# EAGLE schematic esquematico_pds (EAGLE 7.3.0)
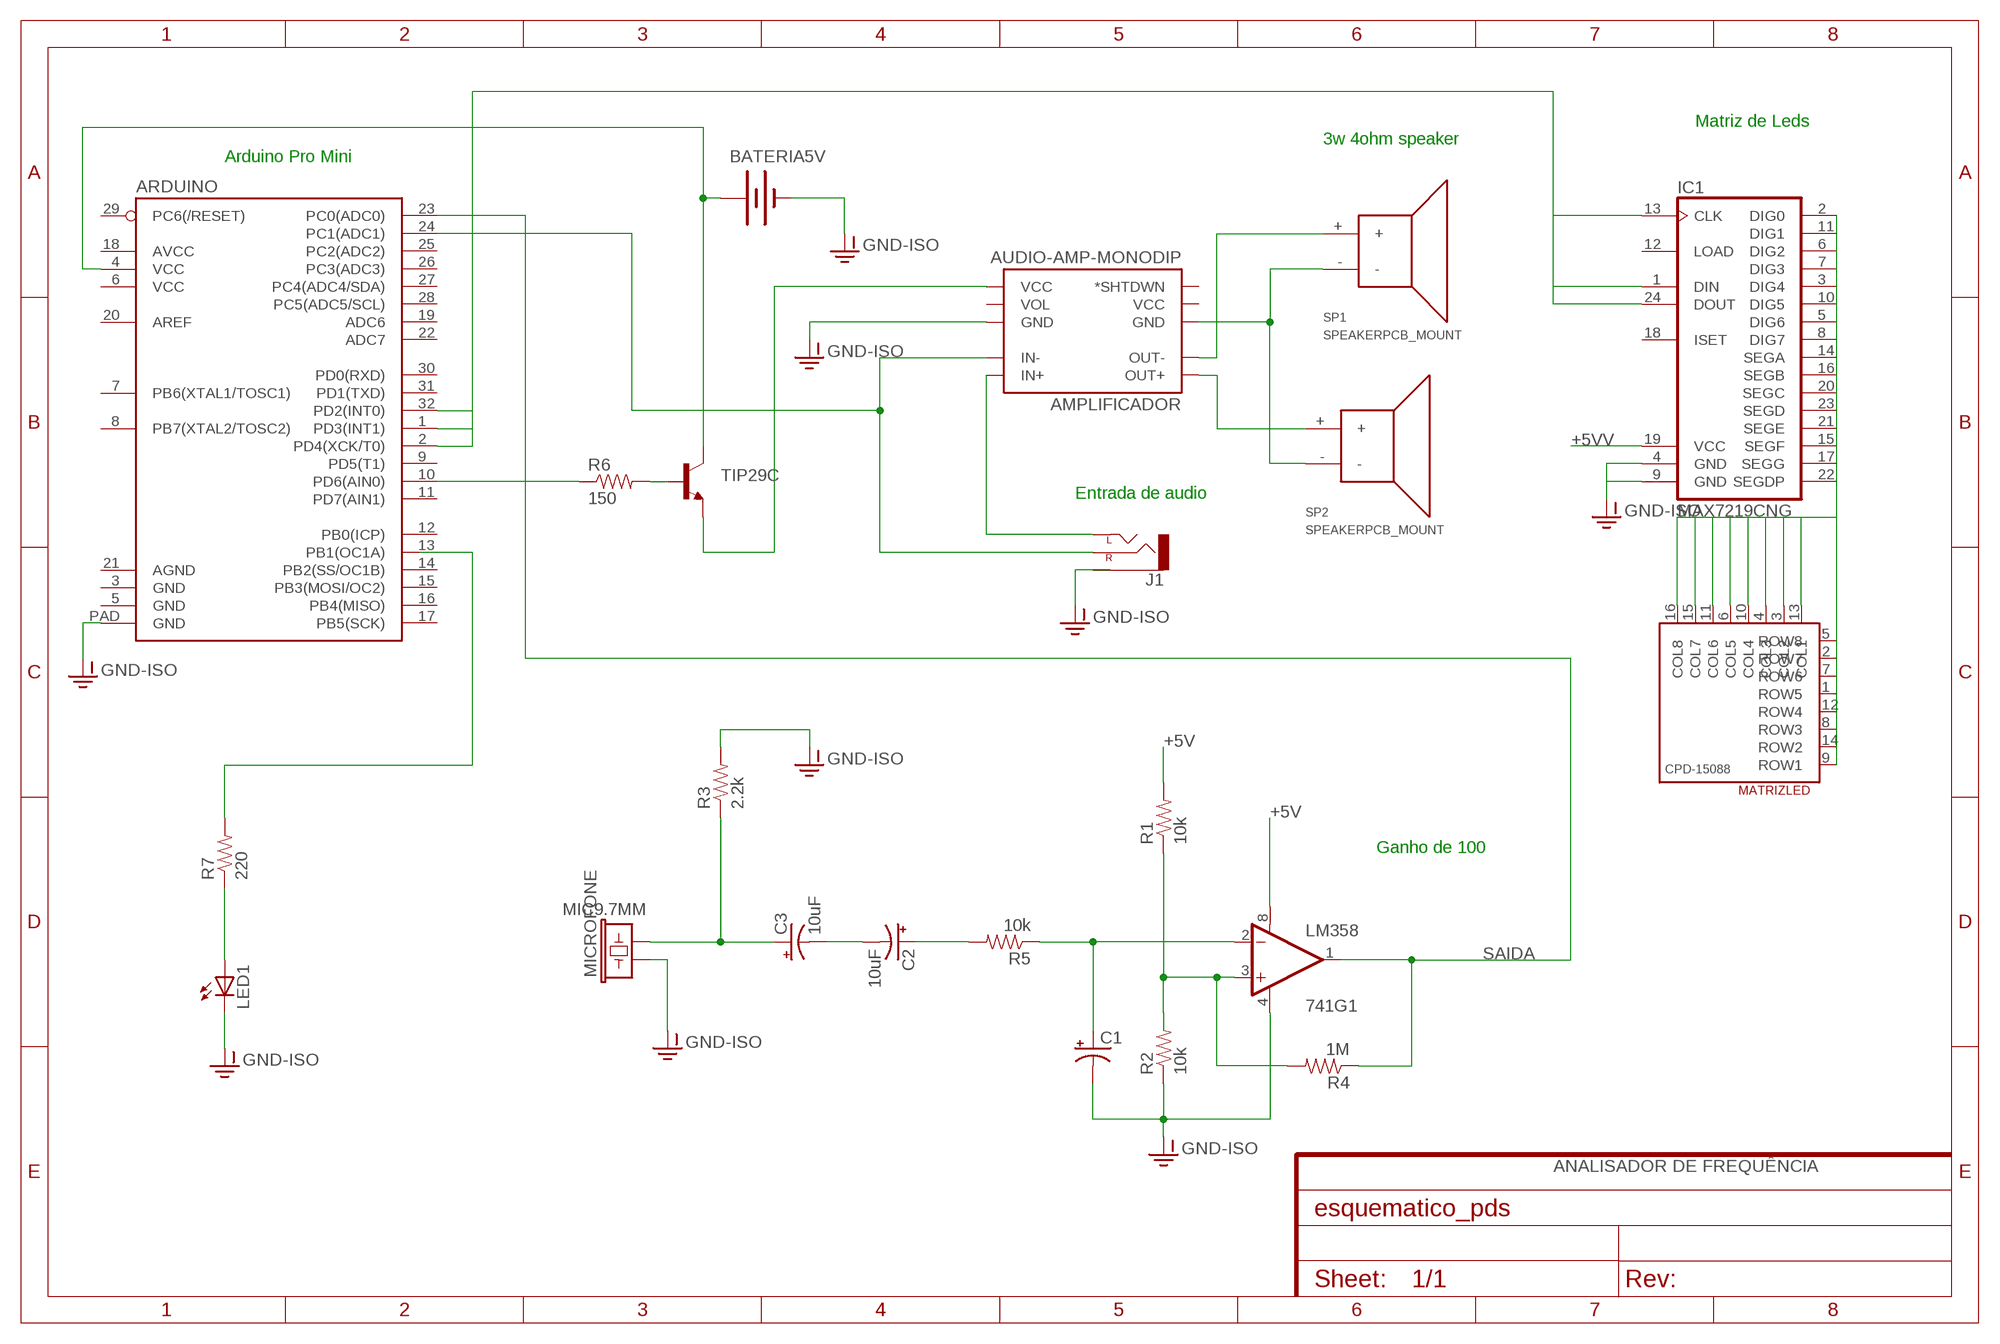
[diagram p0: schematic, sheet 1]
FRAME1 (FRAME-A4L): ANALISADO: ANALISADOR DE FREQUÊNCIA

## Parts
741  LM358  [DIP08]
AMPLIFICADOR  AUDIO-AMP-MONODIP  [AUDIO-AMP-MONO]
ARDUINO  ATMEGA328P_MLFMLF32  [MLF32-PAD]
BATERIA5V  BATTERY9V  [BATTCON_9V]
C1  10UF-25V-20%(PTH)  [CPOL-RADIAL-10UF-25V]
C2  10uF  10UF-25V-20%(PTH)  [CPOL-RADIAL-10UF-25V]
C3  10uF  10UF-25V-20%(PTH)  [CPOL-RADIAL-10UF-25V]
IC1  MAX7219CNG  [DIL24-3]
J1  AUDIO-JACK1:1  [STEREOJACK2.5MM]
LED1  LED1206  [LED-1206]
MATRIZLED  CPD-15088YGD2/A  [CPD15088]
MICROFONE  MIC9.7MM  [MIC-9.7MM]
R1  10k  0.3OHM-1/8W-1%(0805)  [0805]
R2  10k  0.3OHM-1/8W-1%(0805)  [0805]
R3  2.2k  0.3OHM-1/8W-1%(0805)  [0805]
R4  1M  0.3OHM-1/8W-1%(0805)  [0805]
R5  10k  0.3OHM-1/8W-1%(0805)  [0805]
R6  150  RESISTOR0402  [0402-RES]
R7  220  RESISTOR0402  [0402-RES]
SP1  SPEAKERPCB_MOUNT  [PCB_MOUNT_SPEAKER]
SP2  SPEAKERPCB_MOUNT  [PCB_MOUNT_SPEAKER]
TIP29C  TRANSISTOR_NPN2N3904  [TO-92]

## Nets
+5V: R1.2
+5VCC: 741.8(V+)
+5VV: IC1.19(VCC)
GND-ISO: 741.4(V-) AMPLIFICADOR.VOL-(GND) ARDUINO.PAD(GND) BATERIA5V.- C1.2(-) LED1.C MICROFONE.1 R2.1 R3.2
N$1: C3.1(+) MICROFONE.2 R3.1
N$2: 741.2(-IN) C1.1(+) R5.1
N$3: C2.1(+) R5.2
N$4: C2.2(-) C3.2(-)
N$5: ARDUINO.10(PD6(AIN0)) R6.1
N$6: AMPLIFICADOR.OUT- SP1.+
N$7: AMPLIFICADOR.OUT+ SP2.+
N$8: AMPLIFICADOR.PWR-(GND) SP1.- SP2.-
N$9: R6.2 TIP29C.2(B)
N$10: 741.3(+IN) R1.1 R2.2 R4.2
N$11: LED1.A R7.1
N$12: AMPLIFICADOR.VOL+(VCC) TIP29C.1(E)
N$13: AMPLIFICADOR.IN+ J1.1(LEFT)
N$14: AMPLIFICADOR.IN- ARDUINO.24(PC1(ADC1)) J1.4(RIGHT)
N$15: ARDUINO.4(VCC) BATERIA5V.+ TIP29C.3(C)
N$16: R7.2
N$17: IC1.2(DIG0) IC1.5(DIG6) IC1.8(DIG7) IC1.14(SEGA) IC1.15(SEGF) IC1.16(SEGB) IC1.17(SEGG) IC1.20(SEGC) IC1.21(SEGE) IC1.22(SEGDP) IC1.23(SEGD) MATRIZLED.1(ROW5) MATRIZLED.2(ROW7) MATRIZLED.3(COL2) MATRIZLED.4(COL3) MATRIZLED.5(ROW8) MATRIZLED.6(COL5) MATRIZLED.7(ROW6) MATRIZLED.8(ROW3) MATRIZLED.9(ROW1) MATRIZLED.10(COL4) MATRIZLED.11(COL6) MATRIZLED.12(ROW4) MATRIZLED.13(COL1) MATRIZLED.14(ROW2) MATRIZLED.15(COL7) MATRIZLED.16(COL8)
N$18: IC1.4(GND) IC1.9(GND) ; supply symbol labelled GND-ISO
N$20: ARDUINO.1(PD3(INT1)) ARDUINO.2(PD4(XCK/T0)) ARDUINO.32(PD2(INT0)) IC1.1(DIN) IC1.13(CLK) IC1.24(DOUT)
SAIDA: 741.1(OUT) ARDUINO.23(PC0(ADC0)) R4.1
Unconnected: 741.5(+IN) 741.6(-IN) 741.7(OUT) AMPLIFICADOR.PWR+(VCC) AMPLIFICADOR.S(*SHTDWN) AMPLIFICADOR.VOL ARDUINO.3(GND) ARDUINO.5(GND) ARDUINO.6(VCC) ARDUINO.7(PB6(XTAL1/TOSC1)) ARDUINO.8(PB7(XTAL2/TOSC2)) ARDUINO.9(PD5(T1)) ARDUINO.11(PD7(AIN1)) ARDUINO.12(PB0(ICP)) ARDUINO.13(PB1(OC1A)) ARDUINO.14(PB2(SS/OC1B)) ARDUINO.15(PB3(MOSI/OC2)) ARDUINO.16(PB4(MISO)) ARDUINO.17(PB5(SCK)) ARDUINO.18(AVCC) ARDUINO.19(ADC6) ARDUINO.20(AREF) ARDUINO.21(AGND) ARDUINO.22(ADC7) ARDUINO.25(PC2(ADC2)) ARDUINO.26(PC3(ADC3)) ARDUINO.27(PC4(ADC4/SDA)) ARDUINO.28(PC5(ADC5/SCL)) ARDUINO.29(PC6(/RESET)) ARDUINO.30(PD0(RXD)) ARDUINO.31(PD1(TXD)) IC1.3(DIG4) IC1.6(DIG2) IC1.7(DIG3) IC1.10(DIG5) IC1.11(DIG1) IC1.12(LOAD) IC1.18(ISET) J1.5(SLEEVE)

## Notes on the sheet
- Matriz de Leds
- 3w 4ohm speaker
- Arduino Pro Mini
- Entrada de audio
- Ganho de 100

## Library data of the parts
741 = SparkFun-AnalogIC:LM358: Jellybean op-amp; PROD_ID: IC-09172
AMPLIFICADOR = SparkFun-Boards:AUDIO-AMP-MONO
ARDUINO = SparkFun-DigitalIC:ATMEGA328P_MLF: 32-Pin Atmega328 part Commonly used on Arduino compatible boards Available in QFP and QFN packages TQFP is IC-09069 QFN is non-stock
BATERIA5V = SparkFun-Electromechanical:BATTERY: Battery Holders Various common sizes : AA, AAA, 18650 (PRT-12895), 20mm coin cell and 12mm coin cell. 20MM_4LEGS, BATT-10373
C1-C3 = SparkFun-Capacitors:10UF-25V-20%(PTH): CAP-08440; PROD_ID: CAP-08440
IC1 = max7219:MAX7219CNG: LED DISPLAY DRIVER; MF: MAXIM; MPN: MAX7219CNG; OC_FARNELL: 1523914; OC_NEWARK: 34C4018
J1 = SparkFun-Connectors:AUDIO-JACK: 3.5mm Audio Jack Simple 3.5mm common PCB mount audio jack. Variant PTH is our storefront SKU PRT-08032
LED1 = LilyPad-Wearables:LED: LEDs Standard schematic elements and footprints for 5mm, 3mm, 1206, and 0603 sized LEDs. 5mm - Spark Fun Electronics SKU : Comp-SBL
MATRIZLED = LED:CPD-15088: CPD-15088A YGD2/A Green 8x8 LED matrix
MICROFONE = SparkFun-Sensors:MIC: Omni-directional electret microphone. 9.7mm standard diameter.; PROD_ID: COMP-08856
R1-R5 = SparkFun-Resistors:0.3OHM-1/8W-1%(0805): RES-11622; PROD_ID: RES-11622; VALUE: 0.3
R6 R7 = SparkFun-Resistors:RESISTOR: Resistor Basic schematic elements and footprints for 0603, 1206, and PTH resistors.
SP1 SP2 = SparkFun-Electromechanical:SPEAKER: General speakers.; MFG: SANCO; PROD_#: NA; SKU: COM-11089; SPARKLE_ID: 6504
TIP29C = SparkFun-DiscreteSemi:TRANSISTOR_NPN: Generic NPN BJT MMBT2222A - TRANS-08049 (SOT-23, 1A 40V) MPSA42 - TRANS-09116 (SOT-23, 500mA 300V) MMBT5088LT1G - TRANS-11160 (SOT-23, 50 mA 30V) BC547 - COM-08928 <http://www.sparkfun.com/products/8928> (TO-92 45V 100mA) (1.Collector 2.Base 3.Emitter) 2N3904 - COM-00521 <http://www.sparkfun.com/products/521> (TO-92 40V 200mA) (1.Emitter 2.Base 3.Collector) P2N2222A - COM-12852 <http://www.sparkfun.com/products/12852> (TO-92 40V 600mA) (1.Collector 2.Base 3.Emitter); PROD_ID: TRANS-08447

## Module E
Ports: 

### Library data of the parts